# EAGLE design Rocket_Sensor_revM (EAGLE 9.6.1)
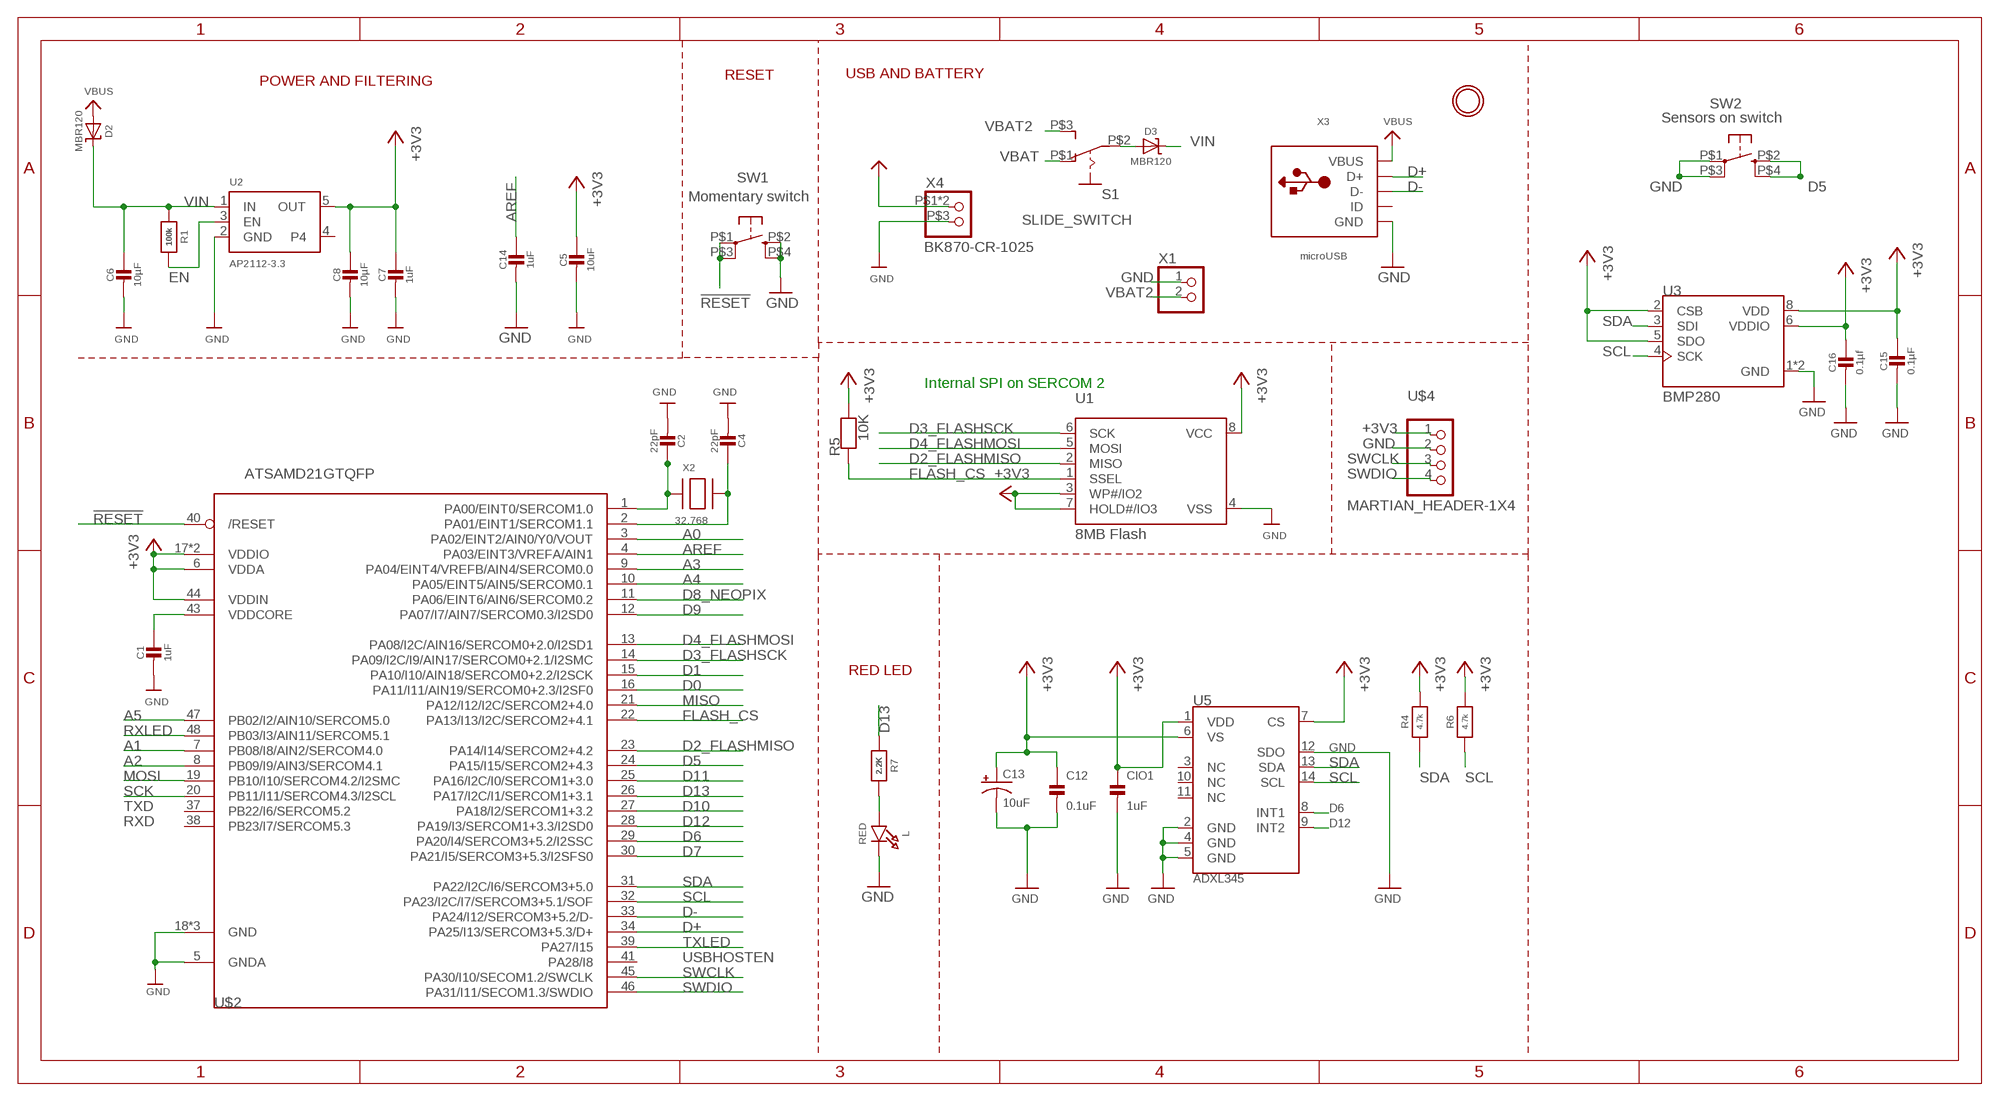
[diagram p0: schematic, sheet 1]

## Parts
C1  1uF  MICROBUILDER_CAP_CERAMIC_1206  [MICROBUILDER__1206]
C2  22pF  MICROBUILDER_CAP_CERAMIC_1206  [MICROBUILDER__1206]
C4  22pF  MICROBUILDER_CAP_CERAMIC_1206  [MICROBUILDER__1206]
C5  10uF  MICROBUILDER_CAP_CERAMIC_1206  [MICROBUILDER__1206]
C6  10µF  MICROBUILDER_CAP_CERAMIC_1206  [MICROBUILDER__1206]
C7  1uF  MICROBUILDER_CAP_CERAMIC_1206  [MICROBUILDER__1206]
C8  10µF  MICROBUILDER_CAP_CERAMIC_1206  [MICROBUILDER__1206]
C12  0.1uF  MICROBUILDER_CAP_CERAMIC_1206  [MICROBUILDER__1206]
C13  10uF  10UF-POLAR-EIA3216-16V-10%(TANT)  [EIA3216]
C14  1uF  MICROBUILDER_CAP_CERAMIC_1206  [MICROBUILDER__1206]
C15  0.1µF  MICROBUILDER_CAP_CERAMIC_1206  [MICROBUILDER__1206]
C16  0.1µf  MICROBUILDER_CAP_CERAMIC_1206  [MICROBUILDER__1206]
CIO1  1uF  MICROBUILDER_CAP_CERAMIC_1206  [MICROBUILDER__1206]
D2  MBR120  MICROBUILDER_DIODE-SCHOTTKYSOD-123  [MICROBUILDER_SOD-123]
D3  MBR120  MICROBUILDER_DIODE-SCHOTTKYSOD-123  [MICROBUILDER_SOD-123]
L  RED  MICROBUILDER_LED1206  [MICROBUILDER_CHIPLED_1206]
R1  100k  MICROBUILDER_RESISTOR_0805  [MICROBUILDER__0805]
R4  4.7k  MICROBUILDER_RESISTOR_0805  [MICROBUILDER__0805]
R5  10K  MICROBUILDER_RESISTOR_0805  [MICROBUILDER__0805]
R6  4.7k  MICROBUILDER_RESISTOR_0805  [MICROBUILDER__0805]
R7  2.2K  MICROBUILDER_RESISTOR_0805  [MICROBUILDER__0805]
S1  SLIDE_SWITCH  MSK12C02_SLIDE_SWITCH  [MSK12C02_SLIDE_SWITCH]
SW1  Momentary switch  ALIEXPRESS_WHITE_TACTILE_PUSHBUTTON  [ALIEXPRESS_WHITE_TACTILE_PUSHBUTTON]
SW2  Sensors on switch  ALIEXPRESS_WHITE_TACTILE_PUSHBUTTON  [ALIEXPRESS_WHITE_TACTILE_PUSHBUTTON]
U1  8MB Flash  MICROBUILDER_SPIFLASH_SOIC8208MIL  [MICROBUILDER_SOIC8_208MIL]
U2  AP2112-3.3  MICROBUILDER_VREG_SOT23-5  [MICROBUILDER_SOT23-5]
U3  BMP280  [XDCR_BMP280]
U5  ADXL345  [LGA-14]
U$2  ATSAMD21GTQFP  MICROBUILDER_ATSAMD21GTQFP  [TQFP-48]
U$4  MARTIAN_HEADER-1X4  [MARTIAN_1X4_ROUND]
U$7  MICROBUILDER_MOUNTINGHOLE2.0  [MICROBUILDER_MOUNTINGHOLE_2.0_PLATED]
X1  MICROBUILDER_CON_JST_PH_2PIN  [MICROBUILDER_JSTPH2]
X2  32.768  ADAFRUIT2_XTAL-3.2X1.5  [ADAFRUIT2_XTAL3215]
X3  microUSB  ALIEXPRESS_MICROUSB_RECEPTICLEV2  [ALIEXPRESS_MICROUSB_RECEPTICLE_V2]
X4  BK870-CR-1025  BK870-CR-1025_COIN_CELL_RETAINER  [BK870-CR-1025_COIN_CELL_RETAINER]

## Nets
!RESET: SW1.P$1(P) SW1.P$3(P1) U$2.40(/RESET)
+3V3: C5.1 C7.1 C8.1 C12.1 C13.+ C15.1 C16.1 CIO1.1 R4.2 R5.2 R6.2 U1.3(WP#/IO2) U1.7(HOLD#/IO3) U1.8(VCC) U2.5(OUT) U3.2(CSB) U3.5(SDO) U3.6(VDDIO) U3.8(VDD) U5.1(VDD) U5.6(VS) U5.7(CS) U$2.6(VDDA) U$2.17(VDDIO) U$2.36(VDDIO) U$2.44(VDDIN) U$4.1
A0: U$2.3(PA02/EINT2/AIN0/Y0/VOUT)
A1: U$2.7(PB08/I8/AIN2/SERCOM4.0)
A2: U$2.8(PB09/I9/AIN3/SERCOM4.1)
A3: U$2.9(PA04/EINT4/VREFB/AIN4/SERCOM0.0)
A4: U$2.10(PA05/EINT5/AIN5/SERCOM0.1)
A5: U$2.47(PB02/I2/AIN10/SERCOM5.0)
AREF: C14.1 U$2.4(PA03/EINT3/VREFA/AIN1)
D0: U$2.16(PA11/I11/AIN19/SERCOM0+2.3/I2SF0)
D1: U$2.15(PA10/I10/AIN18/SERCOM0+2.2/I2SCK)
D2_FLASHMISO: U1.2(MISO) U$2.23(PA14/I14/SERCOM2+4.2)
D3_FLASHSCK: U1.6(SCK) U$2.14(PA09/I2C/I9/AIN17/SERCOM0+2.1/I2SMC)
D4_FLASHMOSI: U1.5(MOSI) U$2.13(PA08/I2C/AIN16/SERCOM0+2.0/I2SD1)
D5: SW2.P$2(S) SW2.P$4(S1) U$2.24(PA15/I15/SERCOM2+4.3)
D6: U5.8(INT1) U$2.29(PA20/I4/SERCOM3+5.2/I2SSC)
D7: U$2.30(PA21/I5/SERCOM3+5.3/I2SFS0)
D8_NEOPIX: U$2.11(PA06/EINT6/AIN6/SERCOM0.2)
D9: U$2.12(PA07/I7/AIN7/SERCOM0.3/I2SD0)
D10: U$2.27(PA18/I2/SERCOM1+3.2)
D11: U$2.25(PA16/I2C/I0/SERCOM1+3.0)
D12: U5.9(INT2) U$2.28(PA19/I3/SERCOM1+3.3/I2SD0)
D13: R7.1 U$2.26(PA17/I2C/I1/SERCOM1+3.1)
D+: U$2.34(PA25/I13/SERCOM3+5.3/D+) X3.D+
D-: U$2.33(PA24/I12/SERCOM3+5.2/D-) X3.D-
EN: R1.2 U2.3(EN)
FLASH_CS: R5.1 U1.1(SSEL) U$2.22(PA13/I13/I2C/SERCOM2+4.1)
GND: C1.2 C2.2 C4.2 C5.2 C6.2 C7.2 C8.2 C12.2 C13.- C14.2 C15.2 C16.2 CIO1.2 L.C SW1.P$2(S) SW1.P$4(S1) SW2.P$1(P) SW2.P$3(P1) U1.4(VSS) U2.2(GND) U3.1(GND) U3.7(GND) U5.2(GND) U5.4(GND) U5.5(GND) U5.12(SDO) U$2.5(GNDA) U$2.18(GND) U$2.35(GND) U$2.42(GND) U$4.2 X1.1 X3.GND X3.P$6(GND) X3.P$7(GND) X3.P$8(GND) X3.P$9(GND) X4.P$3(GND)
MISO: U$2.21(PA12/I12/I2C/SERCOM2+4.0)
MOSI: U$2.19(PB10/I10/SERCOM4.2/I2SMC)
N$1: D3.A S1.P$2(P)
N$2: L.A R7.2
N$5: C2.1 U$2.1(PA00/EINT0/SERCOM1.0) X2.P$1
N$7: C4.1 U$2.2(PA01/EINT1/SERCOM1.1) X2.P$2
RXLED: U$2.48(PB03/I3/AIN11/SERCOM5.1)
SCK: U$2.20(PB11/I11/SERCOM4.3/I2SCL)
SCL: R6.1 U3.4(SCK) U5.14(SCL) U$2.32(PA23/I2C/I7/SERCOM3+5.1/SOF)
SDA: R4.1 U3.3(SDI) U5.13(SDA) U$2.31(PA22/I2C/I6/SERCOM3+5.0)
SWCLK: U$2.45(PA30/I10/SECOM1.2/SWCLK) U$4.3
SWDIO: U$2.46(PA31/I11/SECOM1.3/SWDIO) U$4.4
TXLED: U$2.39(PA27/I15)
VBAT: S1.P$1(O) X4.P$1(VBAT) X4.P$2(VBAT)
VBAT2: S1.P$3(S) X1.2
VBUS: D2.A X3.VBUS
VDDCORE: C1.1 U$2.43(VDDCORE)
VIN: C6.1 D2.C D3.C R1.1 U2.1(IN)
Unconnected: U2.4 U5.3(NC) U5.10(NC) U5.11(NC) U$2.37(PB22/I6/SERCOM5.2) U$2.38(PB23/I7/SERCOM5.3) U$2.41(PA28/I8) X3.ID

## Notes on the sheet
- RESET | USB AND BATTERY
- POWER AND FILTERING
- Internal SPI on SERCOM 2
- RED LED
- TXD
- RXD
- USBHOSTEN

## Library data of the parts
C1 C2 C4-C8 C12 C14-C16 CIO1 = Rocket_Sensor:MICROBUILDER_CAP_CERAMIC: Ceramic Capacitors For new designs, use the packages preceded by an '_' character since they are more reliable: The following footprints should be used on most boards: _0402 - Standard footprint for regular board layouts _0603 - Standard footprint for regular board layouts _0805 - Standard footprint for regular board layouts _1206 - Standard footprint for regular board layouts For extremely tight-pitch boards where space is at a premium, the following 'micro-pitch' footprints can be used (smaller pads, no silkscreen outline, etc.): _0402MP - Micro-pitch footprint for very dense/compact boards _0603MP - Micro-pitch footprint for very dense/compact boards _0805MP - Micro-pitch footprint for very dense/compact boards _1206MP - Micro-pitch footprint for very dense/compact boards
C13 = Rocket_Sensor:10UF-POLAR: 10.0µF polarized capacitors A capacitor is a passive two-terminal electrical component used to store electrical energy temporarily in an electric field.; PROD_ID: CAP-00811
D2 D3 = Rocket_Sensor:MICROBUILDER_DIODE-SCHOTTKY
L = Rocket_Sensor:MICROBUILDER_LED: LED 0603 - 0603 Surface Mount Package 2mA: Green LED - Low Power (3.9mcd, 2ma, 1.7Vf) - Digikey: 475-2709-2-ND Orange LED - Low Power (9.8mcd, 2ma, 1.8Vf) - Digikey: 475-1194-2-ND Red LED - Low Power (5mcd, 2ma, 1.8Vf) - Digikey: 475-1195-2-ND Yellow LED - Low Power (7mcd, 2ma, 1.8Vf) - Digikey: 475-1196-2-ND 5mA: Blue LED - Low Power (17mcd, 5ma, 2.9Vf) - Digikey: LNJ937W8CRACT-ND 0805 - 0805 Surface Mount Package 2mA: Red LED (8.8mcd, 2mA, 1.8Vf, Clear) - Low Power [Digikey: 475-2510-1-ND] Green LED (5mcd, 2mA, 1.8Vf, Clear) - Low Power [Digikey: 475-2730-1-ND] Yellow LED (11.3mcd, 2mA, 1.8Vf, Clear) - Low Power [Digikey: 475-2555-1-ND] 20mA: Red LED (104mcd, 20mA, Diffused) - LS R976 [Digikey: 475-1278-6-ND] Red LED (12mcd, 20mA, 2.0Vf, Clear) - APT2012EC [Digikey: 754-1128-1-ND] Green LED (15mcd, 20mA, 2.2Vf, Clear) - APT2012GC [Digikey: 754-1131-1-ND] Orange LED (160mcd, 20mA, 2.1Vf, Clear) - APT2012SECK [Digikey: 754-1130-1-ND] 1206 - 1206 Surface Mount Package Green LED (26mcd, 20mA, Diffused) - LG N971 [Digikey: 475-1407-6-ND] Red LED (15mcd, 20mA, Diffused) - LH N974 [Digikey: 475-1416-6-ND] Cree - Cree High-Power Surface Mount LEDs XPEBWT-L1-0000-00D50 - White 111lm 350mA 2.9Vf 6200K 110° XTEAWT-00-0000-00000LEE3 - White 114lm 350mA 2.85Vf 5000K 115° Everlight - Everlight 45-21 Series Surface Mount LEDs 45-21/QK2C-B2832AC2CB2/2T - Warm White 2000mcd 20mA 3.25Vf 3050K 120° 45-21/LK2C-B38452C4CB2/2T - Nuetral White 2000mcd 20mA 3.25Vf 4150K 120° 45-21/LK2C-B50634C6CB2/2T - Cold White 2200mcd 20mA 3.25Vf 5650K 120° PLCC2 Reverse Mount LS T77K-J1L2-1-0-2-R18-Z - Red 11.25mcd 2mA 1.8Vf 630nm 120° LO T77K-L1M2-24-Z - Orange 19.6mcd 2mA 1.8Vf 606nm 120° LY T77K-K2M1-26-Z - Yellow 15.7mcd 2mA 1.8Vf 587nm 120°
R1 R4-R7 = Rocket_Sensor:MICROBUILDER_RESISTOR: Resistors For new designs, use the packages preceded by an '_' character since they are more reliable: The following footprints should be used on most boards: _0402 - Standard footprint for regular board layouts _0603 - Standard footprint for regular board layouts _0805 - Standard footprint for regular board layouts _1206 - Standard footprint for regular board layouts For extremely tight-pitch boards where space is at a premium, the following 'micro-pitch' footprints can be used (smaller pads, no silkscreen outline, etc.): _0402MP - Micro-pitch footprint for very dense/compact boards _0603MP - Micro-pitch footprint for very dense/compact boards _0805MP - Micro-pitch footprint for very dense/compact boards _1206MP - Micro-pitch footprint for very dense/compact boards
S1 = Martian_Partz:MSK12C02_SLIDE_SWITCH
SW1 SW2 = Martian_Partz:ALIEXPRESS_WHITE_TACTILE_PUSHBUTTON
U1 = Rocket_Sensor:MICROBUILDER_SPIFLASH_SOIC8: SOIC8 SPI Flash Be careful with the size since SOIC8 flash comes in several 'widths' SOIC8 150 mil M25P16 - 16Mbit (2Mbit x 8) Serial Flash (75MHz SPI Bus), Supply: 2.7-3.6V Digikey: SOIC8 - M25P16-VMN6P-ND SOIC8 208 mil W25Q16BVSSIG - 16Mbit (2Mbit x 8) Serial Flash (104MHz SPI Bus), Supply: 2.7-3.6V Digikey: SOIC8 - W25Q16BVSSIG-ND
U2 = Rocket_Sensor:MICROBUILDER_VREG_SOT23-5: SOT23-5 Fixed Voltage Regulators Part Current Out V Out V In V Dropout θJA (°C/W) TJ (°C) Digikey Part No. ADP121 150mA 3.3V 3.4-5.5V 0.09V @ 150mA -- -- ADP121-AUJZ33R7CT-ND ADP121 150mA 3.0V 3.1-5.5V 0.09V @ 150mA -- -- ADP121-AUJZ30R7CT-ND ADP122 300mA 3.3V 3.4-5.5V 0.085V @ 300mA -- -- ADP122AUJZ-3.3-R7CT-ND ADP1712 300mA 3.3V 3.5-5.5V 0.17V @ 300mA -- -- ADP1712AUJZ-3.3-R7TR-ND AP7311 (Low Cost) 150mA 3.3V 3.5-6V 0.15V @ 150mA -- -- AP7311-33WG-7DICT-ND LD39015M18R 150mA 1.8V 1.9V-5.5V 0.08V @ 100mA -- -- 497-6977-1-ND LP2985A-33DBVR 150mA 3.3V 3.3-16V 0.28V @ 150mA 206 150 296-18479-1-ND MCP1824T-3302E/OT 300mA 3.3V 3.5V-6V 0.2V @ 300mA -- -- MCP1824T-3302E/OTCT-ND MIC5205-2.5YM5 TR 150mA 2.5V 2.7-16V 0.165V @ 150mA -- -- 576-1257-2-ND MIC5205-3.0YM5 TR 150mA 3.0V 3.2V-16V 0.165V @ 150mA -- -- 576-1258-2-ND MIC5205-3.3YM5 TR 150mA 3.3V 3.5V-16V 0.165V @ 150mA -- -- 576-1259-2-ND TPS780330220 150mA 3.3V+2.2V 3.6-5.5V 250mV Max -- -- 296-23332-1-ND TDA3663/N1,135 100mA 3.3V 3.5-45V 0.18V @ 50mA -- -- 568-5343-1-ND Max operating temp can be calculated using θJA, TJ (max junction temperature), and power in watts. Set the "Maximum Ambient Temperature" until it reaches TJ ("Max Junction Temperature"), which is the absolute limit for safe use of the regulator: Heat Sink Temperature Calculator <http://www.daycounter.com/Calculators/Heat-Sink-Temperature-Calculator.phtml> For example, With 12V source into a 3.3V LP2985 and a 30mA load, we are dissipating (12V-3.3V) * 0.03A = 0.261W. With a θJA of 206 °C/W, a TJ of 150°C, and 261mW we can safely use the chip without a heat sink up to 75°C (=147.1°C Junction Temperature).
U3 = Rocket_Sensor:BMP280: BMP280 Absolute Barometric Pressure Sensor for Battery Powered Devices 2 x 2.5mm; AVAILABILITY: Unavailable; DESCRIPTION: Pressure Sensor 4.35PSI ~ 15.95PSI (30kPa ~ 110kPa) Absolute 16b 8-SMD; DIGIKEY-PURCHASE-URL: https://snapeda.com/shop?store=DigiKey&id=1186631; MF: Bosch; MOUSER-PURCHASE-URL: https://snapeda.com/shop?store=Mouser&id=1186631; MP: BMP280; PACKAGE: SMD-8 Bosch Sensortec; PRICE: None
U5 = Rocket_Sensor:ADXL345: Analog Devices ADXL345 3-Axis SPI/I2C 2/4/8/16g Accelerometer The ADXL345 is a small, thin, low power, 3-axis accelerometer with high resolution (13-bit) measurement at up to ±16g. Digital output data is formatted as 16-bit twos complement and is accessible through either a SPI (3- or 4-wire) or I2C digital interface. Datasheet <https://www.sparkfun.com/datasheets/Sensors/Accelerometer/ADXL345.pdf> SparkFun Products SparkFun Triple Axis Accelerometer Breakout - ADXL345 <https://www.sparkfun.com/products/9836> (SEN-09836) Triple Axis Accelerometer - ADXL345 <https://www.sparkfun.com/products/9045> (SEN-09045) SparkFun 6 Degrees of Freedom IMU Digital Combo Board - ITG3200/ADXL345 <https://www.sparkfun.com/products/10121> (SEN-10121); PROD_ID: IC-09097; SF_ID: SEN-09045
U$2 = Rocket_Sensor:MICROBUILDER_ATSAMD21G
U$4 = Rocket_Sensor:MARTIAN_HEADER-1X4: Standard round .1" spacing round pads for breadboard
U$7 = Rocket_Sensor:MICROBUILDER_MOUNTINGHOLE: Mounting Hole For #2 screws (0.086"/2.18mm width, 0.094"/2.4mm hole) use 2.5mm; BOM: EXCLUDE
X1 = Rocket_Sensor:MICROBUILDER_CON_JST_PH_2PIN: JST 2-Pin Right-Angle Connector PH-Series - 4UConnector: 17311 SH-Series - 4UConnector: 07278
X2 = Rocket_Sensor:ADAFRUIT2_XTAL: Low cost SMT crystals, no capacitors included http://www.ladyada.net/library/eagle
X3 = Martian_Partz:ALIEXPRESS_MICROUSB_RECEPTICLE: cltgxdd 10pcs 5 Pin SMT USB Connector Micro USB Type B Female Placement SMD DIP Socket Connector for Lenovo A3000 Huawei C8500 https://www.aliexpress.com/item/32955720844.html?spm=a2g0s.9042311.0.0.27424c4dUvShiI
X4 = Rocket_Sensor:BK870-CR-1025_COIN_CELL_RETAINER

## Board
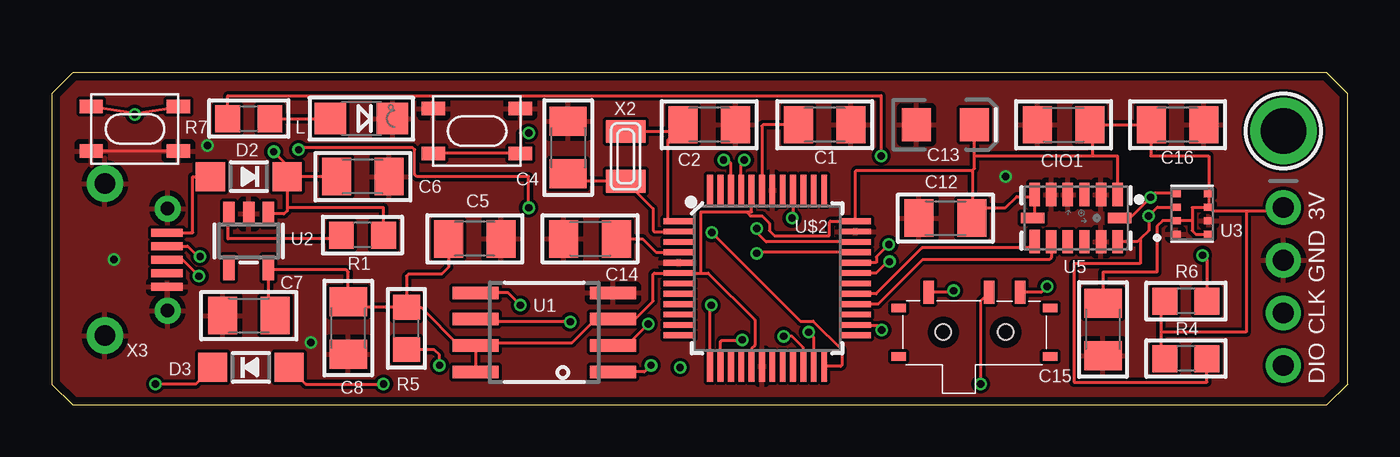
[diagram p1: board, top side]
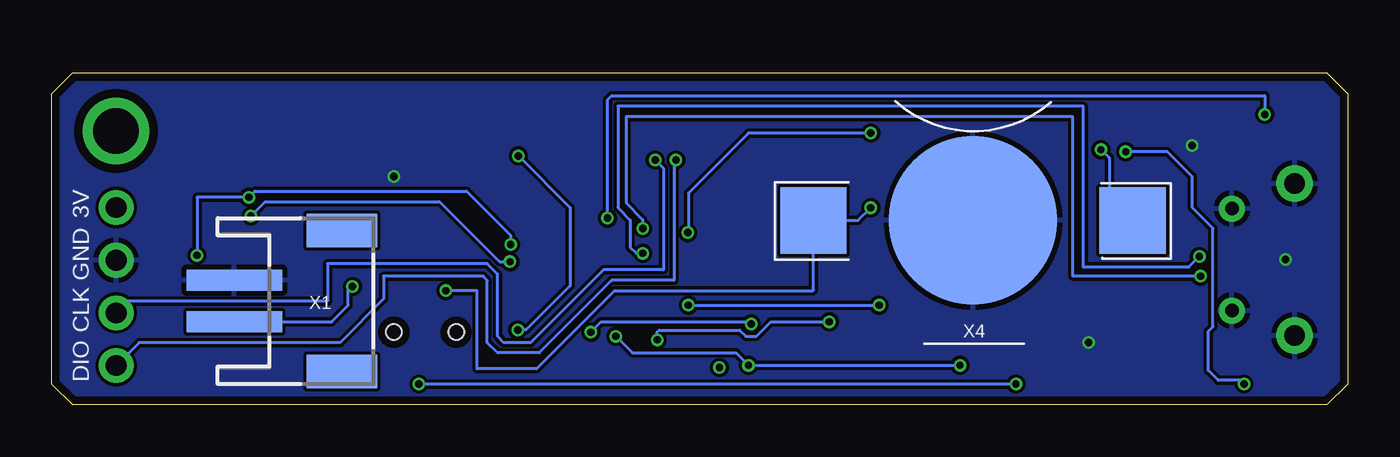
[diagram p2: board, bottom side, seen from below]

Size 62.5 x 16 mm. Coordinates in mm from the lower left corner, seen from the top.
Outline: 1,0 61.5,0 62.5,1 62.5,15 61.5,16 1,16 0,15 0,1 1,0
Copper layers (1*16): Top 0.035559375mm / dielectric 1.6mm / Bottom 0.035559375mm
Design rules "oshpark-2layer": minimum track width 6mil, minimum drill 10mil, track to track 6mil, track to pad 6mil, pad to pad 6mil, via to via 6mil, smd to smd 6mil, copper to edge 15mil, drill to drill 6mil, minimum pad ring 5mil, minimum via ring 5mil, stop-mask expansion 2.5mil, vias tented up to drill 0mil, thermal gap 10mil

### Footprints (pad centres in the part's own frame; a part is rotated, then mirrored left to right if it is on the bottom)
MICROBUILDER__1206 = smd 1.4 x 1.8: 1 -1.27,0; 2 1.27,0
EIA3216 = smd 1.4 x 1.6: + 1.4,0; - -1.4,0
MICROBUILDER_SOD-123 = smd 1.4 x 1.4: A 1.85,0; C -1.85,0
MICROBUILDER_CHIPLED_1206 = smd 1.5 x 1.5: A 0,-1.496; C 0,1.496
MICROBUILDER__0805 = smd 1.2 x 1.3: 1 -1.016,0; 2 1.016,0
MSK12C02_SLIDE_SWITCH = smd 0.5 x 1.1: P$1 -2.2,1.92; P$2 0.7,1.92; P$3 2.2,1.92 | smd 0.7 x 0.4: P$4 -3.65,-1.17; P$5 3.65,-1.17; P$6 -3.65,1.17; P$7 3.65,1.17 | hole 0.74: -1.5,0; 1.5,0
ALIEXPRESS_WHITE_TACTILE_PUSHBUTTON = smd 1.13 x 0.65: P$1 2.1,1.075; P$2 2.1,-1.075; P$3 -2.1,1.075; P$4 -2.1,-1.075
MICROBUILDER_SOIC8_208MIL = smd 0.6 x 2.2: 1 -1.905,-3.315; 2 -0.635,-3.315; 3 0.635,-3.315; 4 1.905,-3.315; 5 1.905,3.315; 6 0.635,3.315; 7 -0.635,3.315; 8 -1.905,3.315
MICROBUILDER_SOT23-5 = smd 0.55 x 1.2: 1 -0.95,-1.3; 2 0,-1.3; 3 0.95,-1.3; 4 0.95,1.3; 5 -0.95,1.3
XDCR_BMP280 = smd 0.5 x 0.35: 1 0.8,0.975; 2 0.8,0.325; 3 0.8,-0.325; 4 0.8,-0.975; 5 -0.8,-0.975; 6 -0.8,-0.325; 7 -0.8,0.325; 8 -0.8,0.975
LGA-14 = smd 0.5 x 1.124: 1 2,1.138; 2 1.2,1.138; 3 0.4,1.138; 4 -0.4,1.138; 5 -1.2,1.138; 6 -2,1.138; 8 -2,-1.13; 9 -1.2,-1.138; 10 -0.4,-1.138; 11 0.4,-1.138; 12 1.2,-1.138; 13 2,-1.138 | smd 1.124 x 0.5: 7 -2.1,0; 14 2.1,0
TQFP-48 = smd 1.5 x 0.28: 1 -4.25,2.75; 2 -4.25,2.25; 3 -4.25,1.75; 4 -4.25,1.25; 5 -4.25,0.75; 6 -4.25,0.25; 7 -4.25,-0.25; 8 -4.25,-0.75; 9 -4.25,-1.25; 10 -4.25,-1.75; 11 -4.25,-2.25; 12 -4.25,-2.75; 25 4.25,-2.75; 26 4.25,-2.25; 27 4.25,-1.75; 28 4.25,-1.25; 29 4.25,-0.75; 30 4.25,-0.25; 31 4.25,0.25; 32 4.25,0.75; 33 4.25,1.25; 34 4.25,1.75; 35 4.25,2.25; 36 4.25,2.75 | smd 0.28 x 1.5: 13 -2.75,-4.25; 14 -2.25,-4.25; 15 -1.75,-4.25; 16 -1.25,-4.25; 17 -0.75,-4.25; 18 -0.25,-4.25; 19 0.25,-4.25; 20 0.75,-4.25; 21 1.25,-4.25; 22 1.75,-4.25; 23 2.25,-4.25; 24 2.75,-4.25; 37 2.75,4.25; 38 2.25,4.25; 39 1.75,4.25; 40 1.25,4.25; 41 0.75,4.25; 42 0.25,4.25; 43 -0.25,4.25; 44 -0.75,4.25; 45 -1.25,4.25; 46 -1.75,4.25; 47 -2.25,4.25; 48 -2.75,4.25
MARTIAN_1X4_ROUND = drill 1 pad 1.676: 1 -3.81,0; 2 -1.27,0; 3 1.27,0; 4 3.81,0
MICROBUILDER_MOUNTINGHOLE_2.0_PLATED = drill 2.2 pad 3: P$1 0,0
MICROBUILDER_JSTPH2 = smd 1 x 4.6: 1 -1,-3.7; 2 1,-3.7 | smd 1.6 x 3.4: NC1 -3.4,1.5; NC2 3.4,1.5
ADAFRUIT2_XTAL3215 = smd 1.1 x 1.9: P$1 1.2,0; P$2 -1.2,0
ALIEXPRESS_MICROUSB_RECEPTICLE_V2 = smd 0.39 x 1.52: D+ 0,-0.76; D- 0.65,-0.76; GND -1.3,-0.76; ID -0.65,-0.76; VBUS 1.3,-0.76 | drill 1 pad 1.75: P$6 -3.665,2.24; P$7 3.665,2.24 | drill 0.64 pad 1.25: P$8 -2.46,-0.78; P$9 2.46,-0.78
BK870-CR-1025_COIN_CELL_RETAINER = smd 3.2 x 3.2: P$1 7.695,0; P$2 -7.695,0 | smd 8.13 x 8.13: P$3 0,0

### Placement (x,y rotation side)
C1  37.28,13.5 0 top
C2  31.71,13.5 0 top
C4  24.9,12.4 90 top
C5  20.4,8 0 top
C6  15,11 0 top
C7  9.5,4.3 180 top
C8  14.3,3.7 270 top
C12  43.1,9 180 top
C13  43.1,13.5 0 top
C14  25.96,8 180 top
C15  50.7,3.63 270 top
C16  54.3,13.5 0 top
CIO1  48.8,13.5 180 top
D2  9.5,11 180 top
D3  9.6,1.8 0 top
L  14.93,13.8 270 top
R1  14.98,8.18 180 top
R4  54.7,2.23 180 top
R5  17.1,3.68 90 top
R6  54.7,5 180 top
R7  9.5,13.8 0 top
S1  44.5,3.5 0 top
SW1  4,13.3 0 top
SW2  20.5,13.2 0 top
U1  23.75,3.49 90 top
U2  9.5,7.9 180 top
U3  55,9.2 180 top
U5  49.4,9 0 top
U$2  34.5,6.1 0 top
U$4  59.4,5.7 270 top
U$7  59.4,13.2 0 top
X1  50,5 270 bottom
X2  27.68,11.98 90 top
X3  4.8,7 90 top
X4  18.07,8.89 0 bottom

### Tracks (layer width: path | path; a pad name or v marks a point on that pad's centre or on a via)
!RESET  (via drill 0.35)
  Top 0.152: U$2.40 35.75,9.05 v35.7,9 | SW1.P$1 4.06,14.06 v4,14 3.94,14.06 SW1.P$3
  Bottom 0.152: v35.7,9 35.7,14.7 35.5,14.9 4,14.9 v4,14
+3V3
  Top 0.152: C7.1 10.45,4.62 10.45,6.5 | 10.45,6.5 U2.5 | 10.45,6.5 14.2,6.5 14.3,6.4 C8.1 14.57,4.7 R5.2 | U1.7 U1.8 | U1.7 20.58,3 25.1,3 26.23,4.12 U1.3 28.12,4.12 29,5 29,6.3 29.05,6.35 U$2.6 31.3,6.35 | R5.2 17.8,4.7 19.64,2.85 U1.7 | C5.1 19.13,6.63 18.8,6.3 17.2,6.3 17.1,6.2 R5.2 | 31.3,6.35 31.3,9.3 33.5,9.3 | 33.5,9.3 33.75,9.3 U$2.44 | 33.5,9.3 33.69,9.11 34.25,9.11 34.61,8.75 34.61,8.39 34.84,8.15 37.5,8.15 37.5,8.8 37.55,8.85 U$2.36 38.75,11.25 38.8,11.3 44.4,11.3 | 31.3,6.35 31.65,6.35 33.91,4.09 33.91,2.88 33.75,2.72 U$2.17 | C13.+ 44.5,12 | U5.7 47.38,9.04 47.4,9.06 U5.6 47.43,10.04 46.54,10.04 46,9.5 44.87,9.5 C12.1 44.4,9.03 44.4,11.3 | R4.2 53.71,2.25 53.5,2.46 53.5,3.5 | 44.4,11.3 44.5,11.4 44.5,12 | 44.5,12 50.2,12 | 50.2,12 50.2,13.37 CIO1.1 C16.1 53,13.47 53,12 55.8,12 U3.5 U3.6 | 50.2,12 51.4,12 U5.1 | U$4.1 59.22,9.32 57.6,9.32 | 57.6,9.32 57.6,3.5 53.5,3.5 | 53.5,3.5 53.5,4.82 R6.2 | U3.6 56,9.32 57.6,9.32 | U3.6 55.77,9.5 55,9.5 55,8.9 | 55,8.9 54.98,8.88 U3.2 53.58,8.88 53.3,8.6 53.3,6.4 50.7,6.4 C15.1 | 55,8.9 55,8.4 55.17,8.22 U3.8
AREF
  Top 0.152: C14.1 28.5,8 29.15,7.35 U$2.4
D2_FLASHMISO  (via drill 0.35)
  Top 0.152: U$2.23 36.75,3.25 v36.5,3.5 | v28.77,3.9 27.67,2.8 27.12,2.8 U1.2
  Bottom 0.152: v36.5,3.5 36,4 28.87,4 v28.77,3.9
D3_FLASHSCK  (via drill 0.35)
  Top 0.152: U$2.14 32.25,3.05 32.3,3.1 33.3,3.1 v33.3,3.13 | v25,4 20.56,4 U1.6
  Bottom 0.152: v33.3,3.13 33.3,3.5 33.2,3.6 29.33,3.6 29.02,3.29 28.52,3.29 27.81,4 v25,4
D4_FLASHMOSI  (via drill 0.35)
  Top 0.152: U$2.13 31.75,4.75 v31.8,4.8 | v22.6,4.8 22,5.39 U1.5
  Bottom 0.152: v31.8,4.8 v22.6,4.8
D5  (via drill 0.35)
  Top 0.152: v23,13.1 22.6,13.1 SW2.P$2 SW2.P$4 | v31.83,8.3 36.1,4.03 36.72,4.03 38.1,2.65 38.1,1.9 38.05,1.85 U$2.24
  Bottom 0.152: v23,13.1 28.9,13.1 31.8,10.2 31.8,8.3 v31.83,8.3
D6
  Top 0.152: U5.8 47.1,7.57 41.97,7.57 39.75,5.35 U$2.29
D12
  Top 0.152: U5.9 48.2,7.1 48.1,7 42,7 39.85,4.85 U$2.28
D13  (via drill 0.35)
  Top 0.152: R7.1 8.48,14.89 8.5,14.9 40,14.9 v40,12 | v40.03,3.61 39.84,3.8 38.8,3.8 U$2.26
  Bottom 0.152: v40,12 37.5,9.5 37.5,5.74 39.63,3.61 v40.03,3.61
D+  (via drill 0.35)
  Top 0.152: X3.D+ 6.3,7 v7.1,6.2 | U$2.34 34.45,7.85 34,8.3 v34,8.5
  Bottom 0.152: v7.1,6.2 13.26,6.2 13.26,13.89 34.8,13.89 34.8,9.73 34,8.93 v34,8.5
D-  (via drill 0.35)
  Top 0.152: X3.D- 6.55,7.65 7.1,7.1 v7.15,7.15 | U$2.33 34.05,7.35 v34,7.3
  Bottom 0.152: v7.15,7.15 7.65,6.65 12.75,6.65 12.75,14.4 35.2,14.4 35.2,9.5 34.61,8.91 34.61,7.61 34.3,7.3 v34,7.3
EN
  Top 0.152: R1.2 13.78,8 8.5,8 8.5,9.15 U2.3
FLASH_CS  (via drill 0.35)
  Top 0.152: U$2.22 36.25,2.75 35.7,3.3 v35.3,3.3 | v28.9,1.9 28.59,1.58 U1.1 | v18.7,1.9 18.7,2.4 18.44,2.66 R5.1
  Bottom 0.152: v35.3,3.3 34.5,2.5 29.5,2.5 v28.9,1.9 v18.7,1.9
GND  (via drill 0.35)
  Top 0.152: SW1.P$2 SW1.P$4
  other vias: 46,11 7.5,12.5 12.5,3 3,7
  pour Top: 0,16 62.5,16 62.5,0 0,0
  pour Bottom: -0.5,16.5 -0.5,-0.5 63,-0.5 63,16.5
N$1  (via drill 0.35)
  Top 0.152: D3.A 12.25,1 v16,1 | v44.8,1 44.8,5.02 S1.P$2
  Bottom 0.152: v16,1 v44.8,1
N$2
  Top 0.152: R7.2 L.A
N$5
  Top 0.152: X2.P$1 30.12,13.18 C2.1 29.7,12.76 29.7,8.9 29.75,8.85 U$2.1
N$6  (via drill 0.35)
  other vias: 30.3,1.8
N$7
  Top 0.152: U$2.2 29.05,8.35 29,8.4 29,9.46 X2.P$2 25.25,10.78 C4.1
SCL  (via drill 0.35)
  Top 0.152: U5.14 52,9 v53,10 53.2,10.2 54.17,10.2 U3.4 | v40.37,7.73 39.77,7.13 39.77,6.85 U$2.32 | v55.5,7.21 55.72,6.99 R6.1
  Bottom 0.152: v40.37,7.73 40.37,8.17 42.5,10.3 52.7,10.3 v53,10 55.5,10 v55.5,7.21
SDA  (via drill 0.35)
  Top 0.152: U5.13 52.36,7.86 52.5,8 | 52.5,8 52.9,8.4 v52.9,9.1 53.33,9.53 U3.3 | v40.4,6.9 40.3,6.9 39.75,6.35 U$2.31 | 52.5,8 52.5,6.8 49.3,6.8 49.3,1.09 55.7,1.09 55.72,1.11 R4.1
  Bottom 0.152: v52.9,9.1 52.2,9.8 43.8,9.8 40.9,6.9 v40.4,6.9
SWCLK  (via drill 0.35)
  Top 0.152: U$2.45 33.25,11.55 33.4,11.7 v33.4,11.8
  Bottom 0.152: v33.4,11.8 33,11.4 33,6.5 35.9,6.5 39.4,3 40.7,3 41,3.3 41,6.3 41.5,6.8 49.2,6.8 49.2,5 58.83,5 U$4.3
SWDIO  (via drill 0.35)
  Top 0.152: U$2.46 32.75,11.65 32.6,11.8 v32.4,11.8
  Bottom 0.152: v32.4,11.8 32.5,11.7 32.5,6 35.5,6 39,2.5 41,2.5 41.5,3 41.5,6 41.7,6.2 46.5,6.2 46.5,5.1 48.6,3 58.29,3 U$4.4
VBAT  (via drill 0.35)
  Top 0.152: v43.5,5.5 43.42,5.42 S1.P$1 | v23,9.5 23,11 17.6,11 17.5,11.1 17.5,12.3 17.4,12.4 11.9,12.4 v11.9,12.3
  Bottom 0.152: v43.5,5.5 42,5.5 42,1.73 39.13,1.73 35.36,5.5 25.8,5.5 25.77,5.54 X4.P$2 23.61,8.89 v23,9.5 | v11.9,12.3 11.5,11.9 11.5,9.5 10.89,8.89 X4.P$1
VBAT2  (via drill 0.35)
  Top 0.152: v48,5.7 47.72,5.42 S1.P$3
  Bottom 0.152: X1.2 49,4 48.2,4.8 48.2,5.7 v48,5.7
VBUS
  Top 0.152: X3.VBUS 6.8,8.3 6.8,11 D2.A
VDDCORE
  Top 0.152: C1.1 34.3,13.5 34.25,13.45 U$2.43
VIN  (via drill 0.35)
  Top 0.152: D2.C 11.35,9.5 | 11.35,9.5 11.35,9.35 11.2,9.2 U2.1 | R1.1 16,9.5 15.99,9.5 11.35,9.5 | C6.1 D2.C | D3.C 6.95,1 v5,1 | v10.7,12.2 11.35,11.55 D2.C
  Bottom 0.152: v5,1 5.17,1.17 6.24,1.17 6.73,1.66 6.73,3.54 6.5,3.77 6.5,8.5 7.5,9.5 7.5,11 8.7,12.2 v10.7,12.2

### Text on the board
tPlace: 3V | GND | CLK | DIO
bPlace: 3V | GND | CLK | DIO